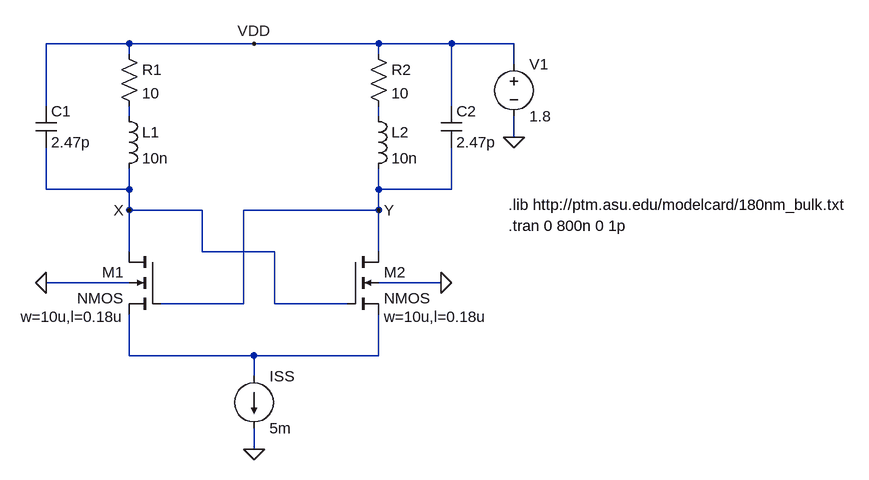
[diagram p0: schematic q4.asc]
q4.asc, the LTspice schematic file:
Version 4
SHEET 1 2136 740
WIRE -112 -16 -240 -16
WIRE 80 -16 -112 -16
WIRE 272 -16 80 -16
WIRE 384 -16 272 -16
WIRE 480 -16 384 -16
WIRE -112 0 -112 -16
WIRE 272 0 272 -16
WIRE 480 16 480 -16
WIRE -240 80 -240 -16
WIRE 384 80 384 -16
WIRE -112 96 -112 80
WIRE 272 96 272 80
WIRE 480 128 480 96
WIRE -240 208 -240 144
WIRE -112 208 -112 176
WIRE -112 208 -240 208
WIRE 272 208 272 176
WIRE 384 208 384 144
WIRE 384 208 272 208
WIRE -112 240 -112 208
WIRE 0 240 -112 240
WIRE 272 240 272 208
WIRE 272 240 64 240
WIRE -112 304 -112 240
WIRE 0 304 0 240
WIRE 112 304 0 304
WIRE 272 304 272 240
WIRE -112 352 -240 352
WIRE 368 352 272 352
WIRE 64 384 64 240
WIRE 64 384 -64 384
WIRE 112 384 112 304
WIRE 224 384 112 384
WIRE -112 464 -112 400
WIRE 80 464 -112 464
WIRE 272 464 272 400
WIRE 272 464 80 464
WIRE 80 496 80 464
WIRE 80 608 80 576
FLAG 80 608 0
FLAG 272 240 Y
FLAG -112 240 X
FLAG 80 -16 VDD
FLAG -240 352 0
FLAG 368 352 0
FLAG 480 128 0
SYMBOL cap -256 80 R0
SYMATTR InstName C1
SYMATTR Value 2.47p
SYMBOL ind -128 80 R0
SYMATTR InstName L1
SYMATTR Value 10n
SYMBOL ind 256 80 R0
SYMATTR InstName L2
SYMATTR Value 10n
SYMBOL cap 368 80 R0
SYMATTR InstName C2
SYMATTR Value 2.47p
SYMBOL nmos4 -64 304 M0
WINDOW 123 56 100 Left 2
SYMATTR InstName M1
SYMATTR Value2 w=10u,l=0.18u
SYMBOL nmos4 224 304 R0
WINDOW 123 56 100 Left 2
SYMATTR InstName M2
SYMATTR Value2 w=10u,l=0.18u
SYMBOL current 80 496 R0
WINDOW 123 0 0 Left 0
WINDOW 39 0 0 Left 0
SYMATTR InstName ISS
SYMATTR Value 5m
SYMBOL res -128 -16 R0
SYMATTR InstName R1
SYMATTR Value 10
SYMBOL res 256 -16 R0
SYMATTR InstName R2
SYMATTR Value 10
SYMBOL voltage 480 0 R0
SYMATTR InstName V1
SYMATTR Value 1.8
TEXT 472 232 Left 2 !.lib http://ptm.asu.edu/modelcard/180nm_bulk.txt
TEXT 472 264 Left 2 !.tran 0 800n 0 1p

The netlist it stands for:
* q4.asc
C1 VDD X 2.47p
L1 N001 X 10n
L2 N002 Y 10n
C2 VDD Y 2.47p
M1 X Y N003 0 NMOS w=10u,l=0.18u
M2 Y X N003 0 NMOS w=10u,l=0.18u
ISS N003 0 5m
R1 VDD N001 10
R2 VDD N002 10
V1 VDD 0 1.8
.model NMOS NMOS
.model PMOS PMOS
.lib standard.mos
.lib http://ptm.asu.edu/modelcard/180nm_bulk.txt
.tran 0 800n 0 1p
.backanno
.end